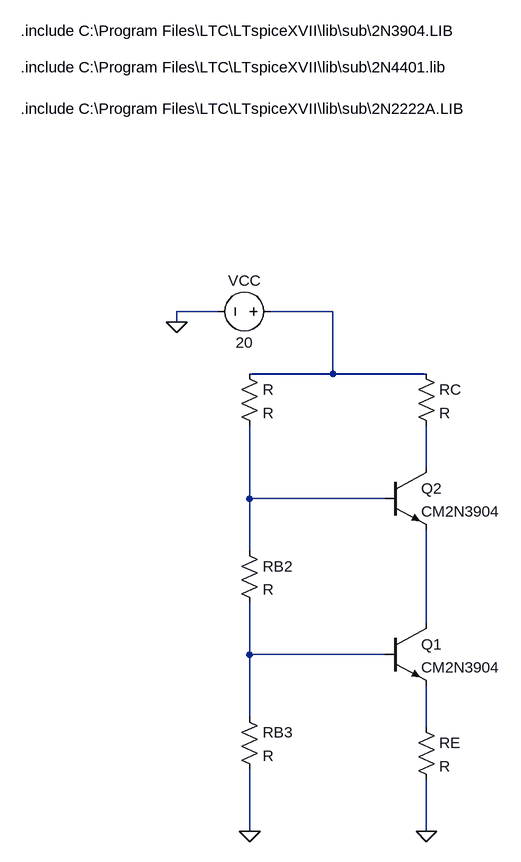
[diagram p0: schematic Cascode model.asc]
Cascode model.asc, the LTspice schematic file:
Version 4
SHEET 1 1036 948
WIRE -32 112 -96 112
WIRE 144 112 48 112
WIRE -96 128 -96 112
WIRE 144 208 144 112
WIRE 144 208 16 208
WIRE 288 208 144 208
WIRE 288 352 288 288
WIRE 16 400 16 288
WIRE 224 400 16 400
WIRE 16 480 16 400
WIRE 288 592 288 448
WIRE 16 640 16 560
WIRE 224 640 16 640
WIRE 16 736 16 640
WIRE 288 752 288 688
WIRE 16 912 16 816
WIRE 288 912 288 832
FLAG -96 128 0
FLAG 288 912 0
FLAG 16 912 0
SYMBOL npn 224 592 R0
SYMATTR InstName Q1
SYMATTR Value CM2N3904
SYMBOL npn 224 352 R0
SYMATTR InstName Q2
SYMATTR Value CM2N3904
SYMBOL res 272 192 R0
SYMATTR InstName RC
SYMBOL res 0 192 R0
SYMATTR InstName R
SYMBOL voltage 64 112 R90
WINDOW 0 -32 56 VBottom 2
WINDOW 3 32 56 VTop 2
WINDOW 123 0 0 Left 0
WINDOW 39 0 0 Left 0
SYMATTR InstName VCC
SYMATTR Value 20
SYMBOL res 0 464 R0
SYMATTR InstName RB2
SYMBOL res 272 736 R0
SYMATTR InstName RE
SYMBOL res 0 720 R0
SYMATTR InstName RB3
TEXT -336 -200 Left 2 !.include C:\\Program Files\\LTC\\LTspiceXVII\\lib\\sub\\2N2222A.LIB
TEXT -336 -264 Left 2 !.include C:\\Program Files\\LTC\\LTspiceXVII\\lib\\sub\\2N4401.lib
TEXT -336 -320 Left 2 !.include C:\\Program Files\\LTC\\LTspiceXVII\\lib\\sub\\2N3904.LIB

The netlist it stands for:
* Cascode model.asc
Q1 N004 N005 N006 0 CM2N3904
Q2 N002 N003 N004 0 CM2N3904
RC N001 N002 R
R N001 N003 R
VCC N001 0 20
RB2 N003 N005 R
RE N006 0 R
RB3 N005 0 R
.model NPN NPN
.model PNP PNP
.lib standard.bjt
.include C:\Program Files\LTC\LTspiceXVII\lib\sub\2N2222A.LIB
.include C:\Program Files\LTC\LTspiceXVII\lib\sub\2N4401.lib
.include C:\Program Files\LTC\LTspiceXVII\lib\sub\2N3904.LIB
.backanno
.end